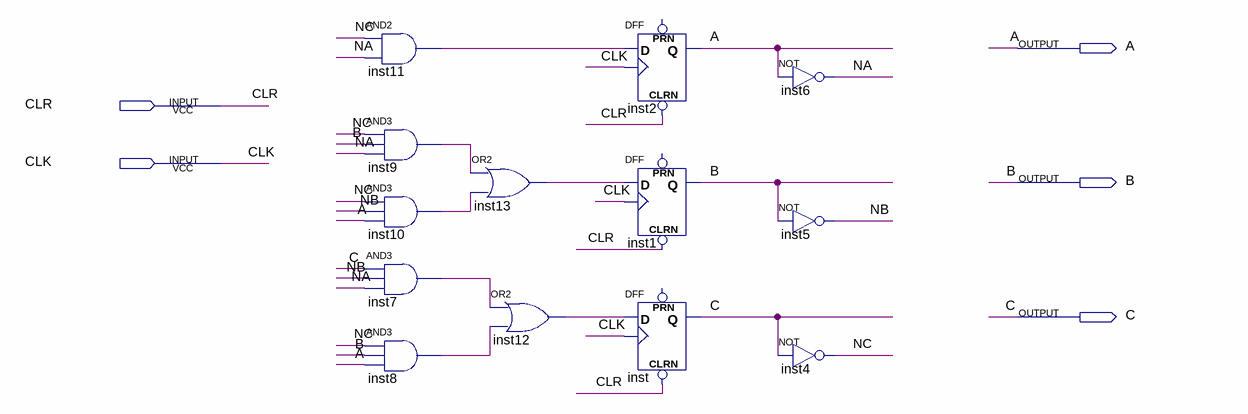
[diagram p0: schematic sheet]
// Quartus schematic add3counter.bdf as structural Verilog: 13 symbols, 5 pins
module add3counter (
  input  CLR,
  input  CLK,
  output A,
  output B,
  output C
);

  wire inst7_out, inst8_out, inst9_out, inst10_out, inst11_out, inst12_out, inst13_out, NA, NB, NC;

  and inst11 (inst11_out, NC, NA);
  and inst9 (inst9_out, NC, B, NA);
  and inst10 (inst10_out, NC, NB, A);
  and inst7 (inst7_out, C, NB, NA);
  and inst8 (inst8_out, NC, B, A);
  or inst13 (inst13_out, inst9_out, inst10_out);
  or inst12 (inst12_out, inst7_out, inst8_out);
  DFF inst2 (.CLRN(CLR), .CLK(CLK), .D(inst11_out), .Q(A));  // open: PRN
  DFF inst1 (.CLRN(CLR), .CLK(CLK), .D(inst13_out), .Q(B));  // open: PRN
  DFF inst (.CLRN(CLR), .CLK(CLK), .D(inst12_out), .Q(C));  // open: PRN
  not inst6 (NA, A);
  not inst5 (NB, B);
  not inst4 (NC, C);
endmodule
